# EAGLE design main_power (EAGLE 9.6.2)
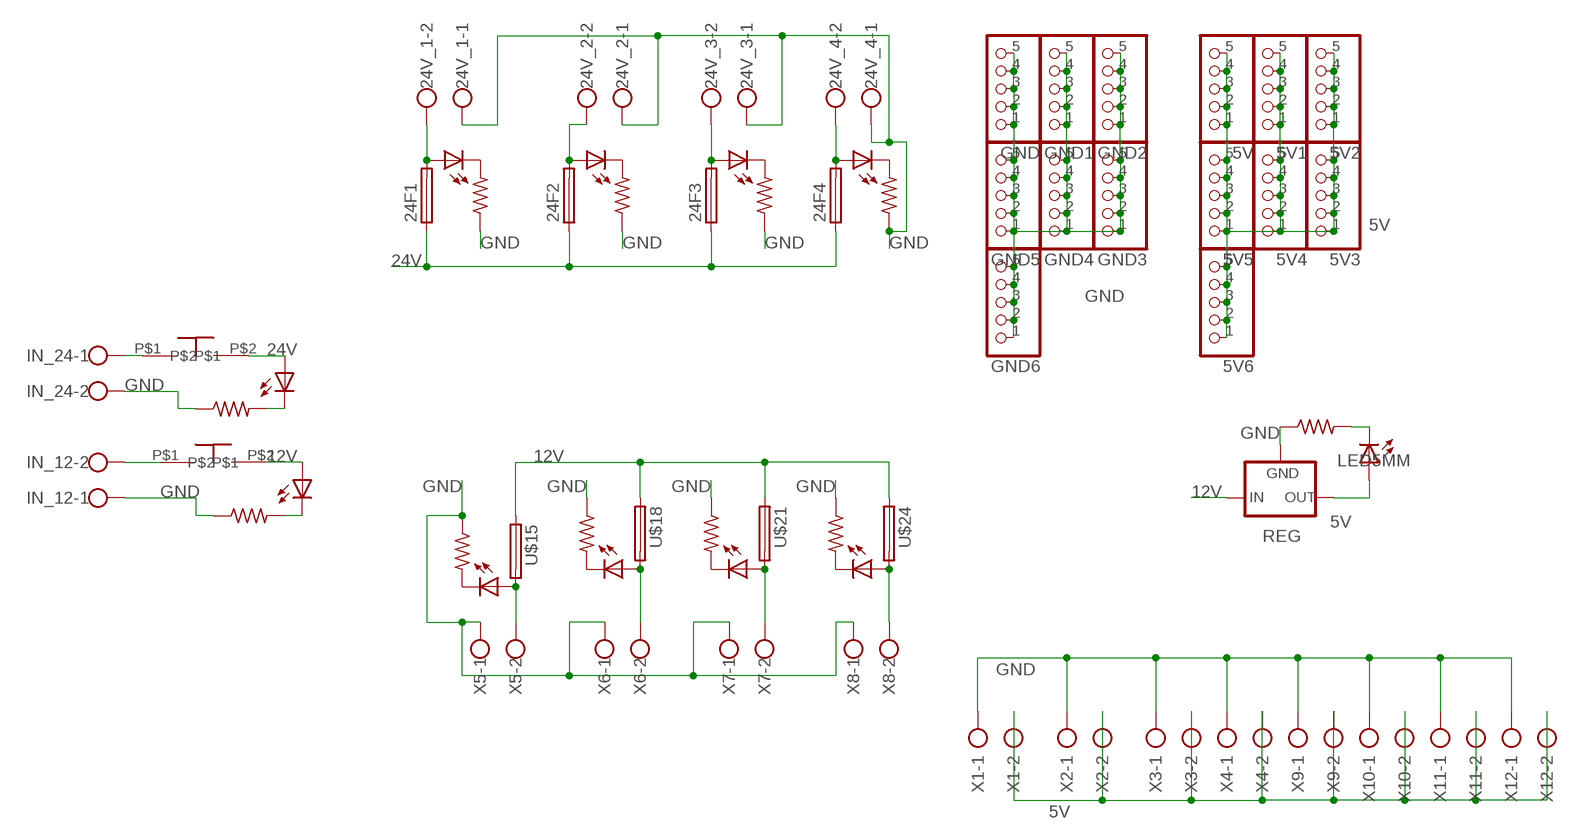
[diagram p0: schematic, sheet 1]

## Parts
5V  PINHD-1X5  [1X05]
5V1  PINHD-1X5  [1X05]
5V2  PINHD-1X5  [1X05]
5V3  PINHD-1X5  [1X05]
5V4  PINHD-1X5  [1X05]
5V5  PINHD-1X5  [1X05]
5V6  PINHD-1X5  [1X05]
12IN  RES-7  [0204/7]
12IND  LED5MM  [LED5MM]
24F1  FUSE_HOLDER  [SH22,5A]
24F2  FUSE_HOLDER  [SH22,5A]
24F3  FUSE_HOLDER  [SH22,5A]
24F4  FUSE_HOLDER  [SH22,5A]
24V_1  ROSTA.POWER  [W239-302]
24V_2  ROSTA.POWER  [W239-302]
24V_3  ROSTA.POWER  [W239-302]
24V_4  ROSTA.POWER  [W239-302]
GND  PINHD-1X5  [1X05]
GND1  PINHD-1X5  [1X05]
GND2  PINHD-1X5  [1X05]
GND3  PINHD-1X5  [1X05]
GND4  PINHD-1X5  [1X05]
GND5  PINHD-1X5  [1X05]
GND6  PINHD-1X5  [1X05]
IN24  LED5MM  [LED5MM]
IN_12  ROSTA.POWER  [W239-302]
IN_24  ROSTA.POWER  [W239-302]
INR24  RES-7  [0204/7]
REG  78XX-METAL  [TO3-79]
U$1  2k  RES-7  [0204/7]
U$2  LED5MM  [LED5MM]
U$4  LED3MM  [LED3MM]
U$5  RES-7  [0204/7]
U$7  LED3MM  [LED3MM]
U$8  RES-7  [0204/7]
U$10  LED3MM  [LED3MM]
U$11  RES-7  [0204/7]
U$13  LED3MM  [LED3MM]
U$14  RES-7  [0204/7]
U$15  FUSE_HOLDER  [SH22,5A]
U$16  LED3MM  [LED3MM]
U$17  RES-7  [0204/7]
U$18  FUSE_HOLDER  [SH22,5A]
U$19  LED3MM  [LED3MM]
U$20  RES-7  [0204/7]
U$21  FUSE_HOLDER  [SH22,5A]
U$22  LED3MM  [LED3MM]
U$23  RES-7  [0204/7]
U$24  FUSE_HOLDER  [SH22,5A]
U$25  LED3MM  [LED3MM]
U$26  RES-7  [0204/7]
U$27  SWITCH_2  [ON_OFF]
U$28  SWITCH_2  [ON_OFF]
X1  AK300/22  [XTALRR488W60L1090T465H350B]
X2  AK300/22  [XTALRR488W60L1090T465H350B]
X3  AK300/22  [XTALRR488W60L1090T465H350B]
X4  AK300/22  [XTALRR488W60L1090T465H350B]
X5  ROSTA.POWER  [W239-302]
X6  ROSTA.POWER  [W239-302]
X7  ROSTA.POWER  [W239-302]
X8  ROSTA.POWER  [W239-302]
X9  AK300/22  [XTALRR488W60L1090T465H350B]
X10  AK300/22  [XTALRR488W60L1090T465H350B]
X11  AK300/22  [XTALRR488W60L1090T465H350B]
X12  AK300/22  [XTALRR488W60L1090T465H350B]

## Nets
5V: 5V1.1 5V1.2 5V1.3 5V1.4 5V1.5 5V2.1 5V2.2 5V2.3 5V2.4 5V2.5 5V3.1 5V3.2 5V3.3 5V3.4 5V3.5 5V4.1 5V4.2 5V4.3 5V4.4 5V4.5 5V5.1 5V5.2 5V5.3 5V5.4 5V5.5 5V6.1 5V6.2 5V6.3 5V6.4 5V6.5 5V.1 5V.2 5V.3 5V.4 5V.5 REG.1(OUT) U$2.A X1.2 X2.2 X3.2 X4.2 X9.2 X10.2 X11.2 X12.2
12V: 12IND.A REG.3(IN) U$15.1 U$18.1 U$21.1 U$24.1 U$28.P$2
24V: 24F1.1 24F2.1 24F3.1 24F4.1 IN24.A U$27.P$2
GND: 12IN.1 24V_1.1 24V_2.1 24V_3.1 24V_4.1 GND1.1 GND1.2 GND1.3 GND1.4 GND1.5 GND2.1 GND2.2 GND2.3 GND2.4 GND2.5 GND3.1 GND3.2 GND3.3 GND3.4 GND3.5 GND4.1 GND4.2 GND4.3 GND4.4 GND4.5 GND5.1 GND5.2 GND5.3 GND5.4 GND5.5 GND6.1 GND6.2 GND6.3 GND6.4 GND6.5 GND.1 GND.2 GND.3 GND.4 GND.5 IN_12.1 IN_24.2 INR24.1 REG.2(GND) U$1.1 U$5.1 U$8.1 U$11.1 U$14.1 U$17.1 U$20.1 U$23.1 U$26.1 X1.1 X2.1 X3.1 X4.1 X5.1 X6.1 X7.1 X8.1 X9.1 X10.1 X11.1 X12.1
N$1: U$1.2 U$2.K(C)
N$2: 24F1.2 24V_1.2 U$4.A
N$3: U$4.K(C) U$5.2
N$4: IN_12.2 U$28.P$1
N$5: 24F2.2 24V_2.2 U$7.A
N$6: U$7.K(C) U$8.2
N$7: IN_24.1 U$27.P$1
N$8: 24F3.2 24V_3.2 U$10.A
N$9: U$10.K(C) U$11.2
N$10: IN24.K(C) INR24.2
N$11: 24F4.2 24V_4.2 U$13.A
N$12: U$13.K(C) U$14.2
N$13: 12IN.2 12IND.K(C)
N$14: U$15.2 U$16.A X5.2
N$15: U$16.K(C) U$17.2
N$17: U$18.2 U$19.A X6.2
N$18: U$19.K(C) U$20.2
N$20: U$21.2 U$22.A X7.2
N$21: U$22.K(C) U$23.2
N$23: U$24.2 U$25.A X8.2
N$24: U$25.K(C) U$26.2

## Library data of the parts
5V 5V1-5V6 GND GND1-GND6 = MIA_LIBRARY-2-2-2:PINHD-1X5: PIN HEADER
12IN INR24 U$1 U$5 U$8 U$11 U$14 U$17 U$20 U$23 U$26 = MIA_LIBRARY-2-2-2:RES-7
12IND IN24 U$2 = MIA_LIBRARY-2-2-2:LED5MM
24F1-24F4 U$15 U$18 U$21 U$24 = MIA_LIBRARY-2-2-2:FUSE_HOLDER
24V_1-24V_4 IN_12 IN_24 X5-X8 = MIA_LIBRARY-2-2-2:ROSTA.POWER: WAGO SCREW CLAMP; OC_FARNELL: unknown; OC_NEWARK: unknown
REG = MIA_LIBRARY (2):78XX-METAL: VOLTAGE REGULATOR
U$4 U$7 U$10 U$13 U$16 U$19 U$22 U$25 = MIA_LIBRARY-2-2-2:LED3MM
U$27 U$28 = MIA_LIBRARY-2-2-2:SWITCH_2
X1-X4 X9-X12 = con-ptr50056:AK300/2: CONNECTOR

## Board
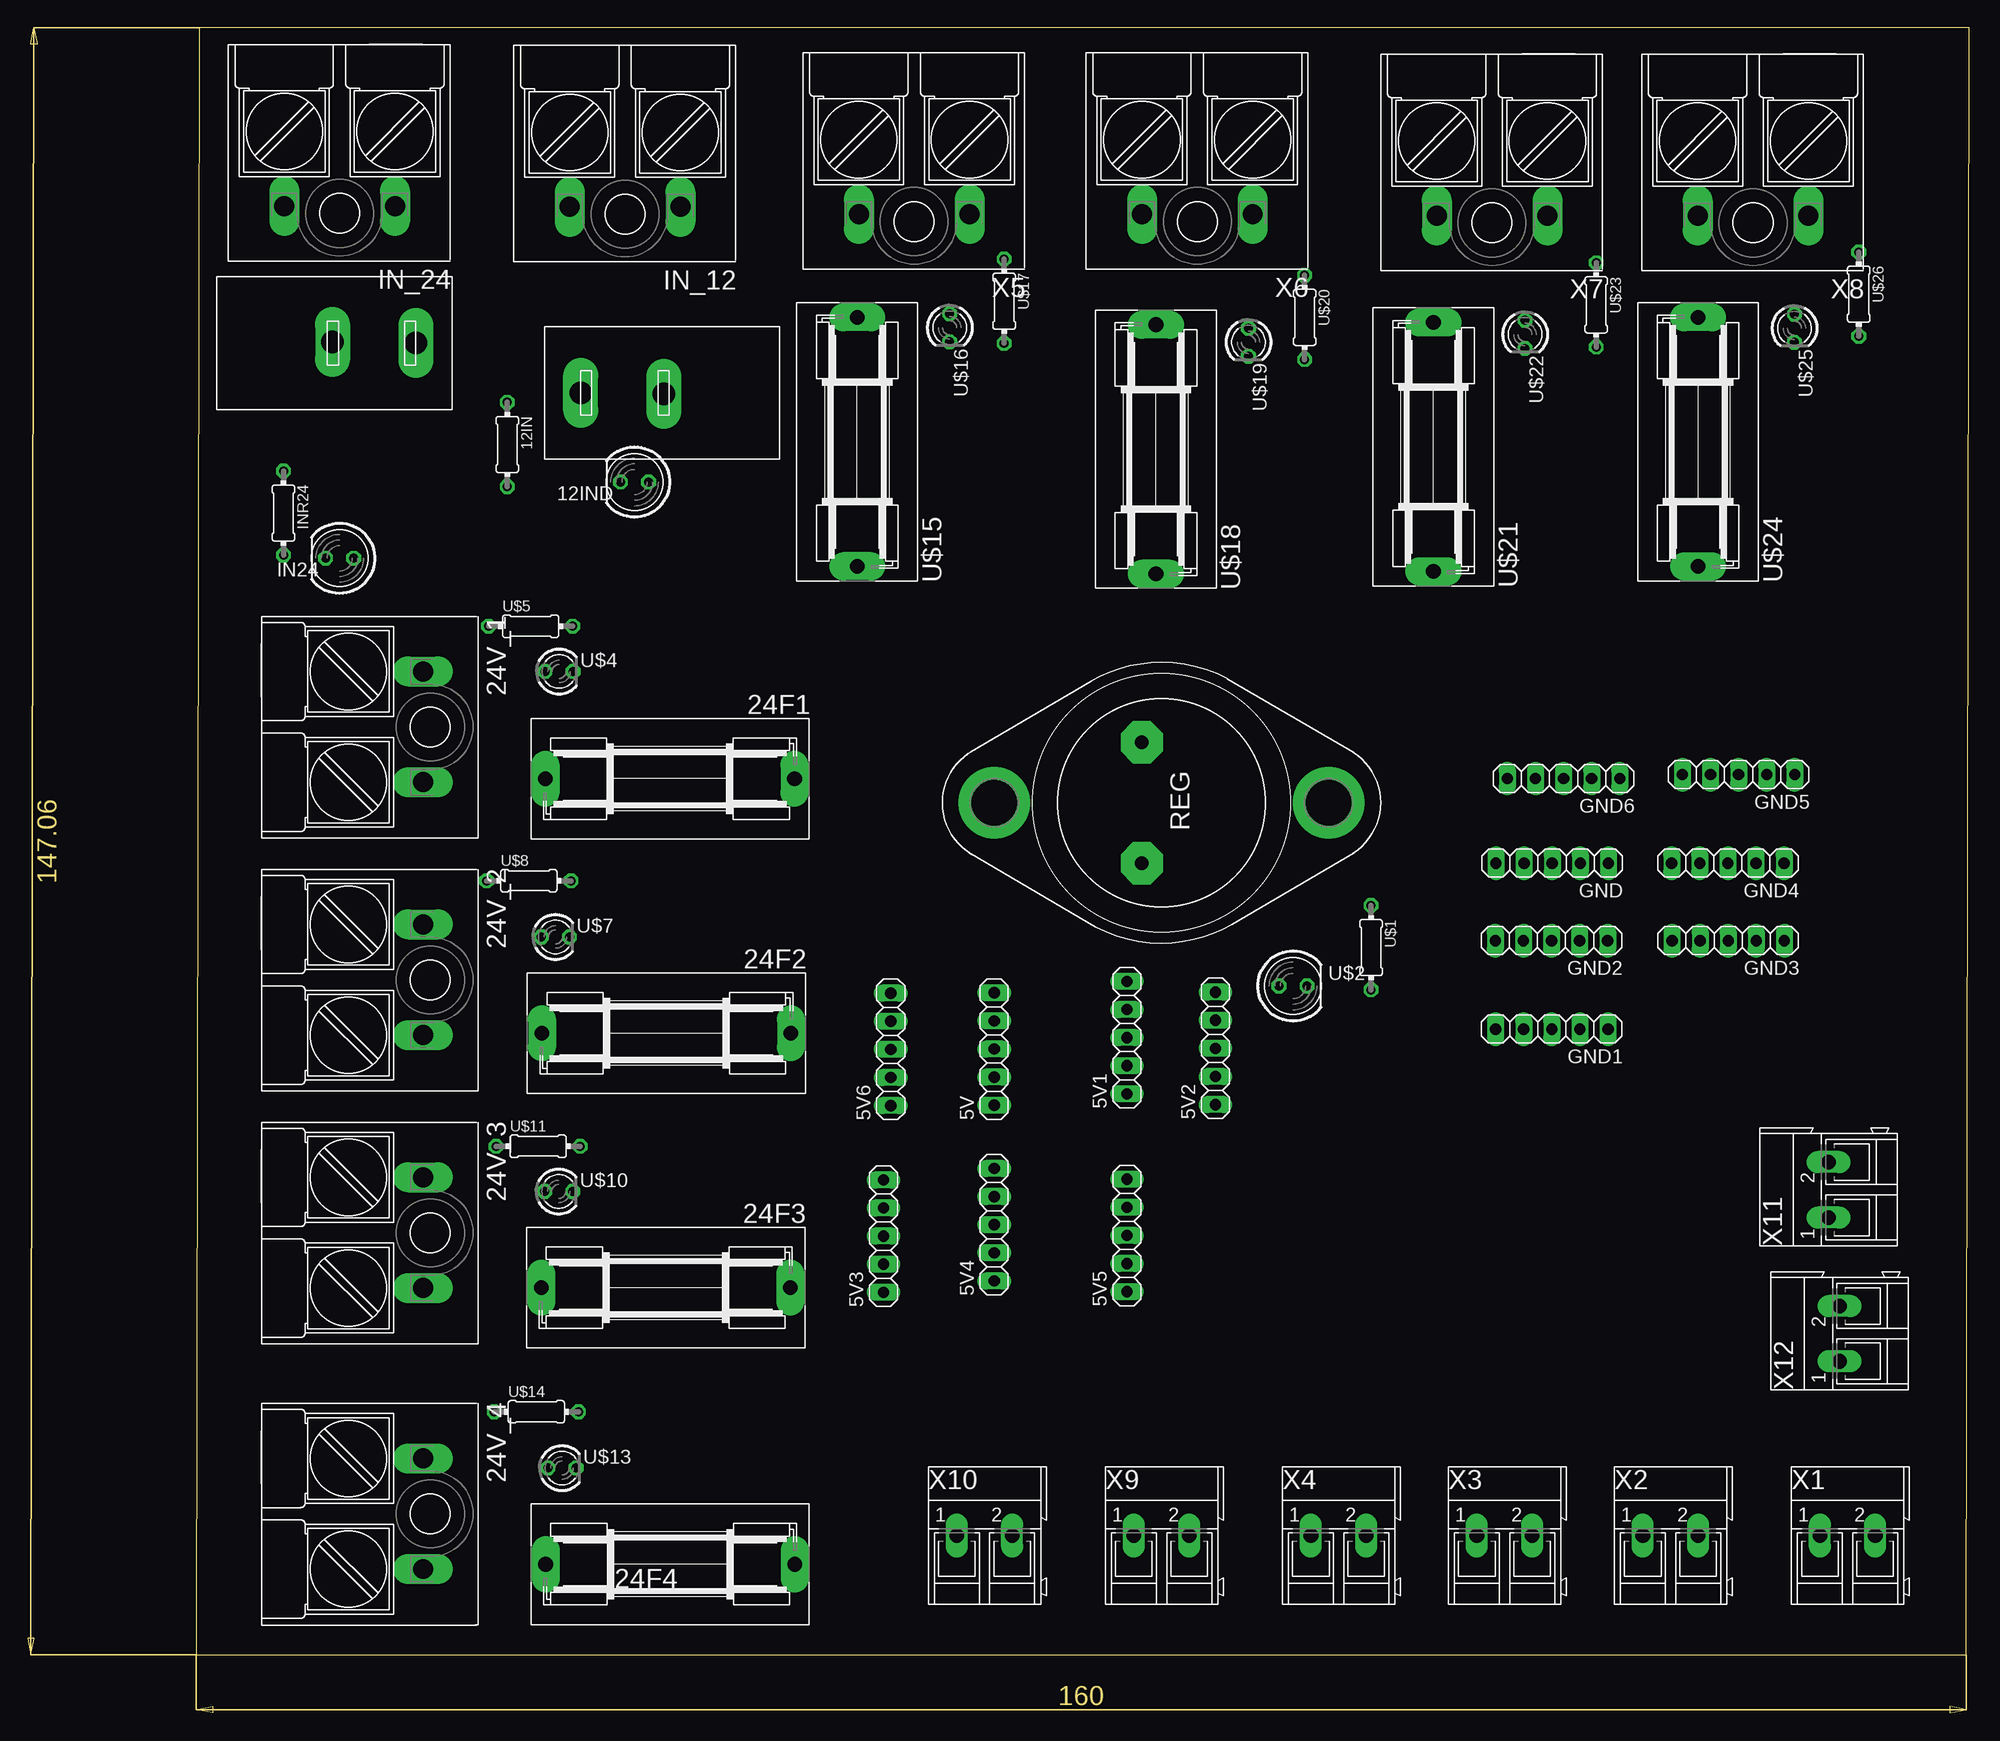
[diagram p1: board, top side]
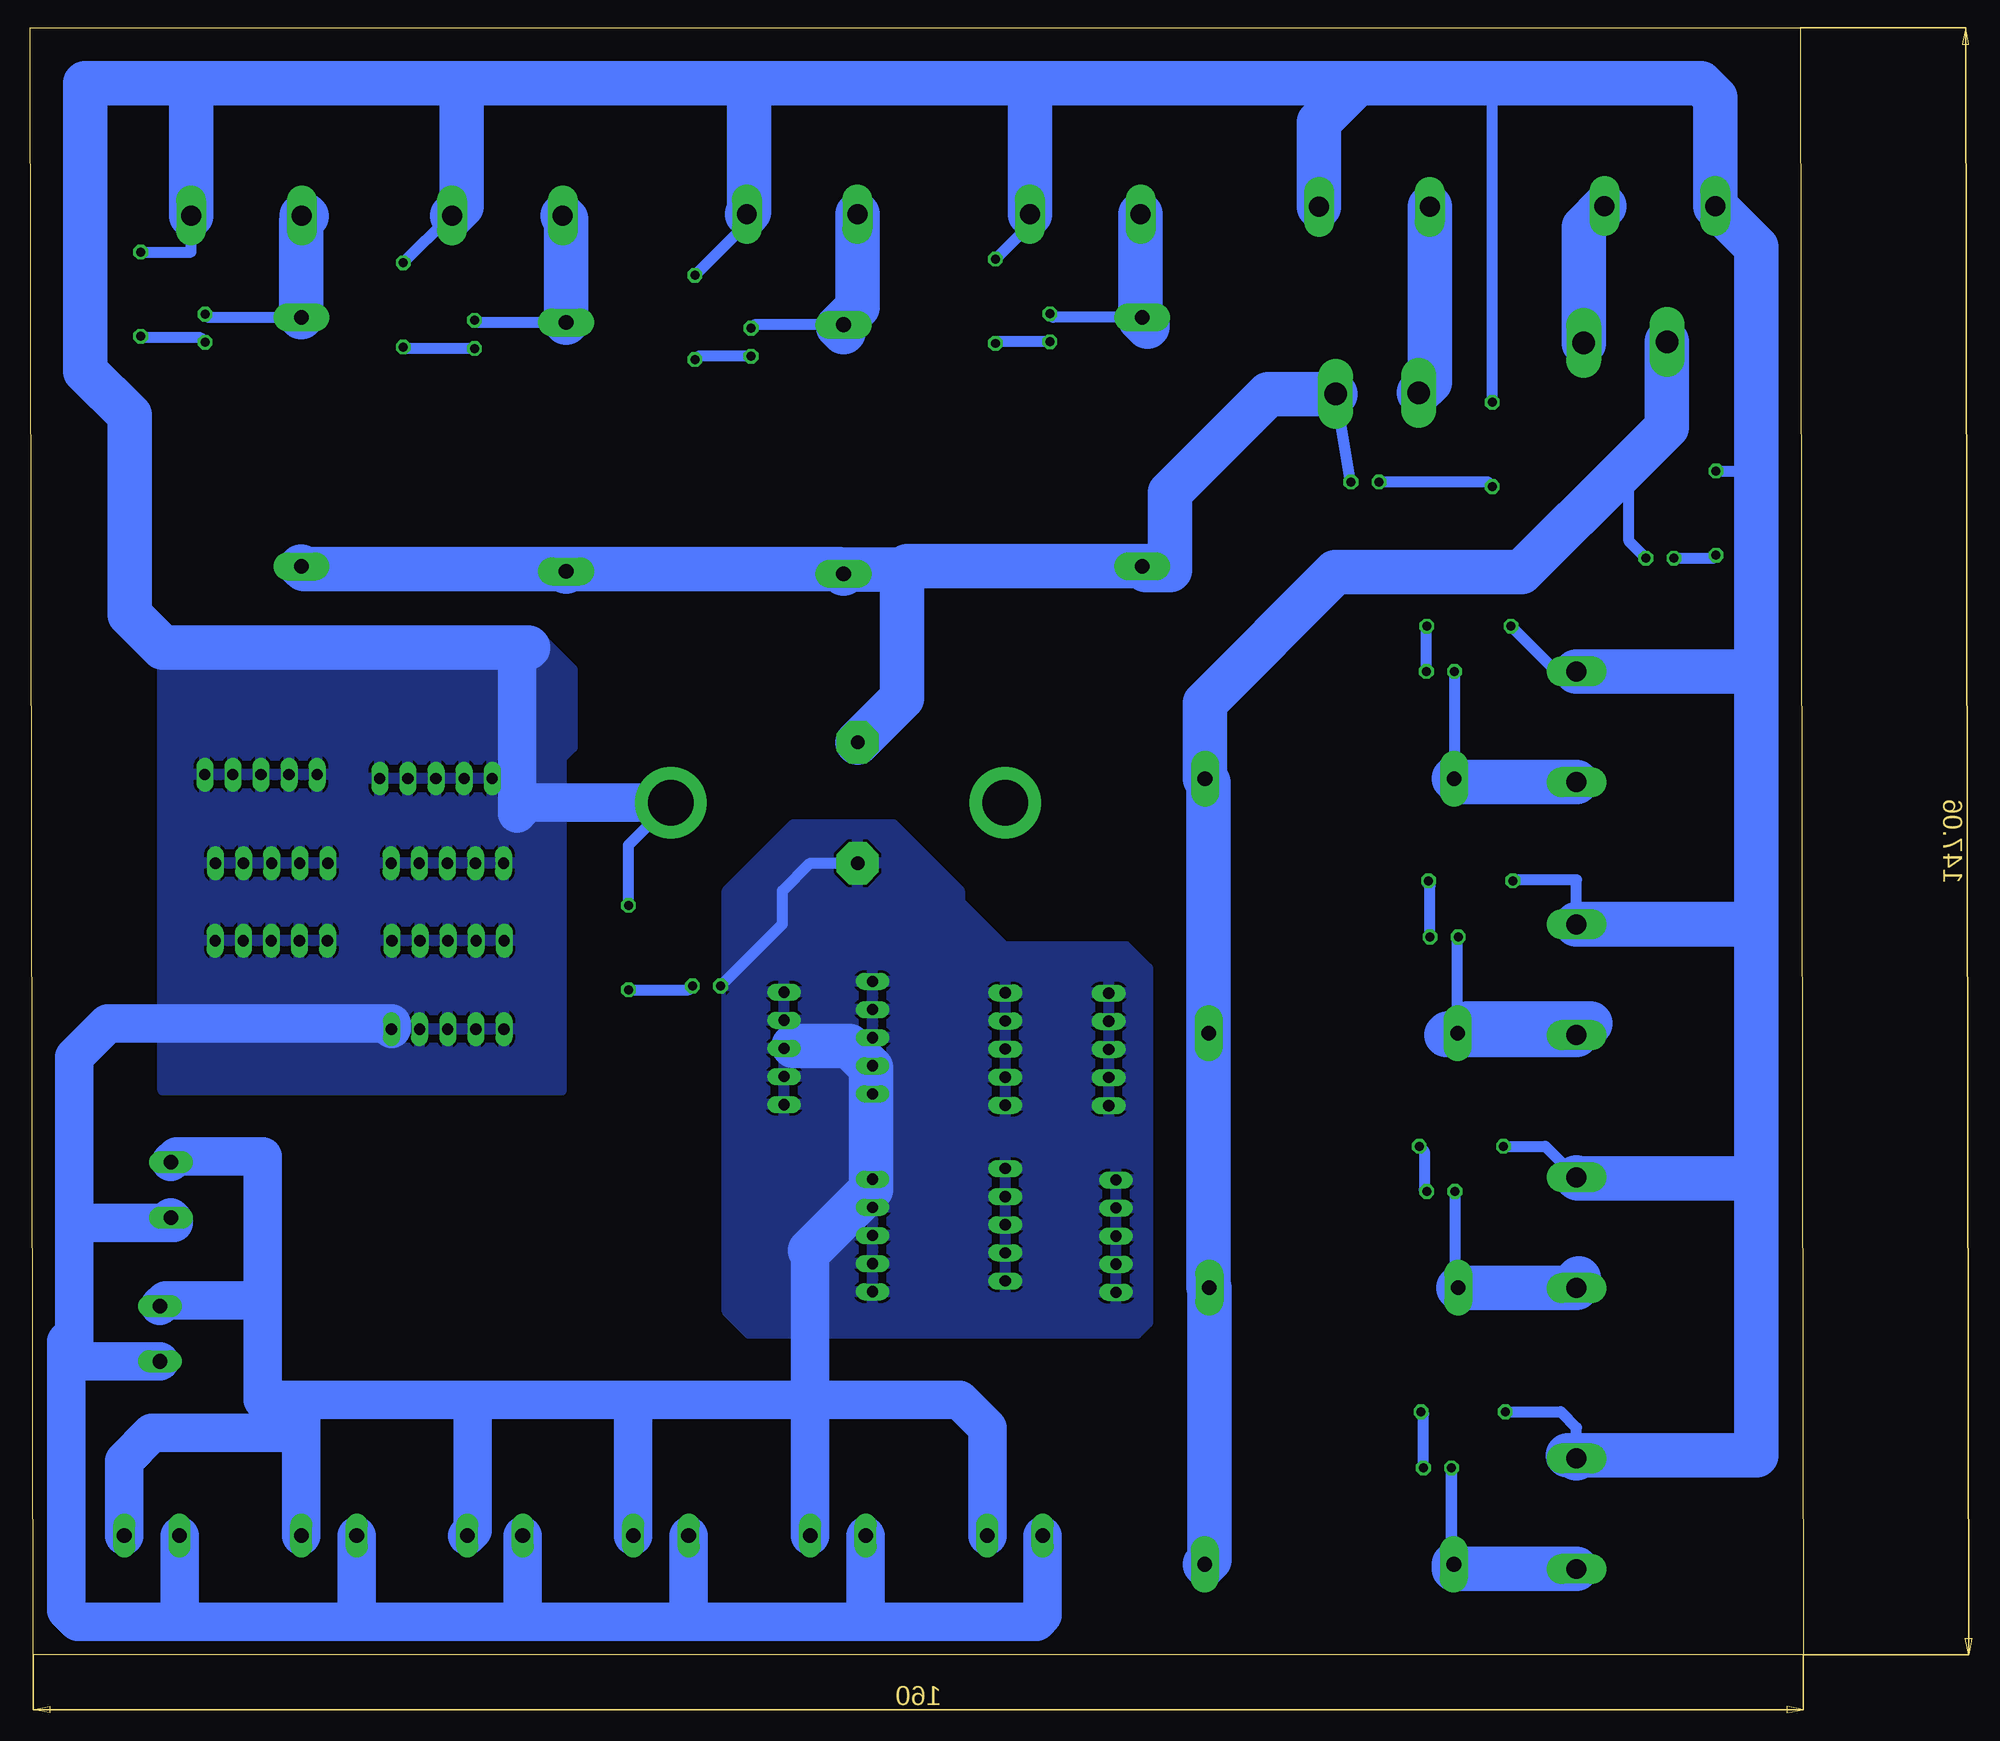
[diagram p2: board, bottom side, seen from below]

Size 160.27 x 147.06 mm. Coordinates in mm from the lower left corner, seen from the top.
Outline: 0,0 160,0 160.27,147.06 0.27,147.06 0,0
Copper layers (1*16): Top 0.035mm / dielectric 1.5mm / Bottom 0.035mm
Design rules "default": minimum track width 6mil, minimum drill 0.35mm, track to track 6mil, track to pad 6mil, pad to pad 6mil, via to via 6mil, smd to smd 6mil, copper to edge 40mil, drill to drill 6mil, minimum pad ring 10mil, minimum via ring 8mil, stop-mask expansion 4mil, vias tented up to drill 0mil, thermal gap 10mil

### Footprints (pad centres in the part's own frame; a part is rotated, then mirrored left to right if it is on the bottom)
1X05 = drill 1.016 long: 1 -5.08,0; 2 -2.54,0; 3 0,0; 4 2.54,0; 5 5.08,0
0204/7 = drill 0.813 octagon: 1 -3.81,0; 2 3.81,0
LED5MM = drill 0.813 octagon: A -1.27,0; K 1.27,0
SH22,5A = drill 1.321 pad 2.54 long: 1 -11.252,0; 2 11.252,0
W239-302 = drill 1.8 long: 1 -5,5; 2 5,5
TO3-79 = drill 1.194 pad 3.81 octagon: 1 -1.778,-5.461; 3 -1.778,5.461 | drill 4.115 pad 6.477: 2 15.113,0; 3@ -15.113,0
LED3MM = drill 0.813 octagon: A -1.27,0; K 1.27,0
ON_OFF = drill 2.032 pad 3.175 long: P$1 3.27,5.952; P$2 10.795,5.842
XTALRR488W60L1090T465H350B = drill 1.321 long: 1 -2.515,-1.27; 2 2.489,-1.27

### Placement (x,y rotation side)
5V  72.13,54.77 90 top
5V1  84.13,55.8 90 top
5V2  92.13,54.83 90 top
5V3  62.13,37.86 90 top
5V4  72.13,38.89 90 top
5V5  84.13,37.92 90 top
5V6  62.78,54.74 90 top
12IN  28.12,109.41 270 top
12IND  39.62,106.02 180 top
24F1  42.83,79.2 180 top
24F2  42.5,56.2 180 top
24F3  42.44,33.2 180 top
24F4  42.84,8.2 180 top
24V_1  15.51,83.89 270 top
24V_2  15.51,61.03 270 top
24V_3  15.51,38.17 270 top
24V_4  15.51,12.77 270 top
GND  122.56,71.57 180 top
GND1  122.53,56.57 180 top
GND2  122.5,64.57 180 top
GND3  138.47,64.57 180 top
GND4  138.44,71.57 180 top
GND5  139.41,79.57 180 top
GND6  123.59,79.22 180 top
IN24  12.97,99.13 180 top
IN_12  38.77,135.9 180 top
IN_24  12.97,135.96 180 top
INR24  7.89,103.21 270 top
REG  87.25,77.03 0 top
U$1  106.19,63.94 270 top
U$2  99.14,60.47 0 top
U$4  32.8,88.9 0 top
U$5  30.23,92.98 0 top
U$7  32.47,64.9 0 top
U$8  30.07,69.98 0 top
U$10  32.77,41.9 0 top
U$11  30.91,45.98 0 top
U$13  33.07,16.9 0 top
U$14  30.75,21.98 0 top
U$15  59.75,109.66 90 top
U$16  68.11,119.96 270 top
U$17  73.03,122.36 270 top
U$18  86.75,108.99 90 top
U$19  95.11,118.66 270 top
U$20  100.19,120.9 270 top
U$21  111.83,109.19 90 top
U$22  120.11,119.36 270 top
U$23  126.54,122.03 270 top
U$24  135.75,109.65 90 top
U$25  144.46,119.92 270 top
U$26  150.27,123 270 top
U$27  23.13,124.53 180 top
U$28  31.48,108.13 0 top
X1  149.27,12.06 0 top
X2  133.27,12.06 0 top
X3  118.27,12.06 0 top
X4  103.27,12.06 0 top
X5  64.9,135.23 180 top
X6  90.49,135.23 180 top
X7  117.13,135.1 180 top
X8  140.72,135.1 180 top
X9  87.27,12.06 0 top
X10  71.27,12.06 0 top
X11  146.27,42.06 90 top
X12  147.27,29.06 90 top

### Tracks (layer width: path | path; a pad name or v marks a point on that pad's centre or on a via)
5V
  Bottom 1: U$2.A 92.27,66.07 92.27,69.06 89.76,71.57 REG.1
  Bottom 3.5: X10.2 73.76,20.55 76.27,23.06 89.27,23.06 | 89.27,23.06 106.27,23.06 | 106.27,23.06 120.27,23.06 | 120.27,23.06 135.27,23.06 | 135.27,23.06 139.27,23.06 139.27,32.06 | 139.27,32.06 139.27,45.06 147.03,45.06 X11.2 | X12.2 148.03,32.06 139.27,32.06 | X2.2 135.76,21.55 | 135.76,21.55 135.76,22.57 135.27,23.06 | X1.2 151.76,17.57 149.27,20.06 136.27,20.06 136.27,22.06 135.76,21.55 | X3.2 120.27,11.28 120.27,23.06 | X4.2 105.76,22.55 106.27,23.06 | X9.2 89.76,22.57 | 89.76,22.57 89.27,23.06 | 89.76,22.57 89.76,36.57
  Bottom 4: 89.76,36.57 84.27,42.06 84.27,53.06 86.27,55.06 91.27,55.06
  pour Bottom: 82.27,75.06 76.27,69.06 76.27,68.06 72.27,64.06 61.27,64.06 59.27,62.06 59.27,30.06 60.27,29.06 95.27,29.06 97.27,31.06 97.27,69.06 91.27,75.06
12V
  Bottom 1: U$28.P$2 41.01,106.14 12IND.A
  Bottom 4: 81.27,98.12 86.37,98.12 U$18.1 87.15,98.14 111.63,98.14 | U$15.1 80.98,98.41 81.27,98.12 | U$15.1 57.92,98.41 | U$21.1 111.63,98.14 | U$24.1 135.49,98.14 111.63,98.14 | REG.3 81.47,86.49 81.47,97.92 81.27,98.12 | U$28.P$2 48.36,113.97 57.27,105.06 57.27,98.06 59.4,98.06 U$15.1
24V
  Bottom 1: IN24.A 15.77,100.66 15.77,107.56
  Bottom 4: 24F4.1 53.69,8.6 24F3.1 53.75,33.26 24F2.1 53.75,78.87 24F1.1 54.08,86.06 42.28,97.86 25.47,97.86 15.77,107.56 12.33,111 U$27.P$2
GND
  Bottom 1: U$11.1 23.32,45.98 20.4,43.06 | 24V_4.1 20.51,20.55 21.94,21.98 U$14.1 | 22.34,66.06 20.48,66.06 | 24V_2.1 20.51,70.06 26.18,70.06 U$8.1 | U$5.1 22.33,88.89 24V_1.1 | INR24.1 5.31,107.02 5.27,107.06 4.27,107.06 | 12IN.1 28.12,141.21 27.27,142.06 | U$20.1 95.49,129.41 X6.1 | U$23.1 122.32,130.06 122.17,130.06 X7.1 | U$1.1 106.19,73.2 REG.2 | U$17.1 69.9,129.3 X5.1 | U$26.1 145.72,126.81 X8.1
  Bottom 3.5: X10.1 68.75,3.58 69.31,3.02 84.27,3.02 | 84.27,3.02 100.27,3.02 | 100.27,3.02 116.27,3.02 | 116.27,3.02 130.27,3.02 | X2.1 130.76,3.5 130.27,3.02 | X3.1 115.75,3.53 116.27,3.02 | X4.1 100.75,3.5 100.27,3.02 | X9.1 84.75,3.5 84.27,3.02 | X12.1 155.76,26.55 156.27,27.06 156.27,29.06 | 156.27,29.06 156.27,39.06 | 156.27,39.06 147.27,39.06 147.27,39.28 X11.1 | 156.27,39.06 156.27,54.06 153.27,57.06 127.61,57.06 GND1.1 | 156.27,29.06 156.99,28.34 156.99,4.06 155.95,3.02 146.76,3.02 | REG.2 115.3,77.03 116.27,76.06 116.27,90.06 115.27,91.06 | X1.1 146.76,3.02 | 130.27,3.02 146.76,3.02
  Bottom 4: 20.51,18.06 4.27,18.06 4.27,43.06 | 4.27,89.06 4.27,107.06 4.27,127.26 IN_24.2 7.97,140.76 9.27,142.06 27.27,142.06 40.27,142.06 | 4.27,43.06 4.27,65.06 | 4.27,65.06 4.27,89.06 | 24V_3.1 20.4,43.06 4.27,43.06 | 5.27,66.06 20.48,66.06 24V_2.1 5.24,66.03 4.27,65.06 | IN_12.1 43.77,138.56 40.27,142.06 | 40.27,142.06 69.9,142.06 | 69.9,142.06 95.27,142.06 | 95.27,142.06 121.27,142.06 | 145.72,142.06 121.27,142.06 | X7.1 121.27,130.96 121.27,142.06 | X6.1 95.27,130.45 95.27,142.06 | X5.1 69.9,142.06 | 115.27,91.06 148.27,91.06 151.27,94.06 151.27,112.06 155.27,116.06 155.27,142.06 145.72,142.06 | 24V_1.1 4.44,88.89 4.27,89.06 | X8.1 145.72,142.06 | 24V_4.1 20.51,18.06 | 20.51,18.06 21.27,18.06
  pour Bottom: 112.27,81.06 112.27,51.06 148.27,51.06 148.27,90.06 146.27,92.06 114.27,92.06 111.27,89.06 111.27,82.06
N$1
  Bottom 1: U$1.2 100.75,60.13 U$2.K
N$2
  Bottom 1: U$4.A 31.54,79.33 31.27,79.06 31.27,78.89
  Bottom 4: 24V_1.2 31.27,78.89 24F1.2
N$3
  Bottom 1: U$4.K 34.08,92.94 U$5.2
N$4
  Bottom 4: U$28.P$1 33.77,115.06 IN_12.2
N$5
  Bottom 1: 24F2.2 31.25,64.85 U$7.A
  Bottom 4: 19.27,57.06 30.39,57.06 24F2.2 32.13,56.2 32.27,56.06 20.54,56.06 24V_2.2
N$6
  Bottom 1: U$7.K 33.74,69.53 34.04,69.83 U$8.2
N$7
  Bottom 4: IN_24.1 19.86,129.07 U$27.P$1
N$8
  Bottom 1: U$10.A 31.5,33.51 24F3.2
  Bottom 4: 20.27,34.06 21.13,33.2 24F3.2 20.54,33.2 24V_3.2
N$9
  Bottom 1: U$11.2 34.27,45.53 34.27,42.06 34.11,41.9 U$10.K
N$10
  Bottom 1: IN24.K 8.16,99.13 INR24.2
N$11
  Bottom 1: 31.8,8.06 U$13.A 31.8,8.2 24F4.2
  Bottom 4: 24V_4.2 31.59,7.77 24F4.2
N$12
  Bottom 1: U$13.K 34.34,21.76 U$14.2
N$13
  Bottom 1: 12IN.2 28.54,106.02 12IND.K
N$14
  Bottom 1: U$15.2 67.79,120.91 U$16.A
  Bottom 4: X5.2 59.9,120.69 59.27,120.06 59.27,120.43 U$15.2
N$15
  Bottom 1: U$16.K 72.89,118.69 U$17.2
N$17
  Bottom 1: U$18.2 94.8,120.24 U$19.A
  Bottom 4: X6.2 85.49,121.84 87.27,120.06 86.77,119.56 86.75,119.58 U$18.2
N$18
  Bottom 1: U$19.K 99.89,117.39 U$20.2
N$20
  Bottom 1: U$21.2 119.92,120.44 U$22.A
  Bottom 4: X7.2 111.83,129.8 U$21.2
N$21
  Bottom 1: U$22.K 126.41,118.09 U$23.2
N$23
  Bottom 1: U$25.A 144.17,120.9 U$24.2
  Bottom 4: U$24.2 135.75,129.58 135.27,130.06 135.31,130.1 X8.2
N$24
  Bottom 1: U$25.K 144.87,119.06 150.27,119.06 U$26.2